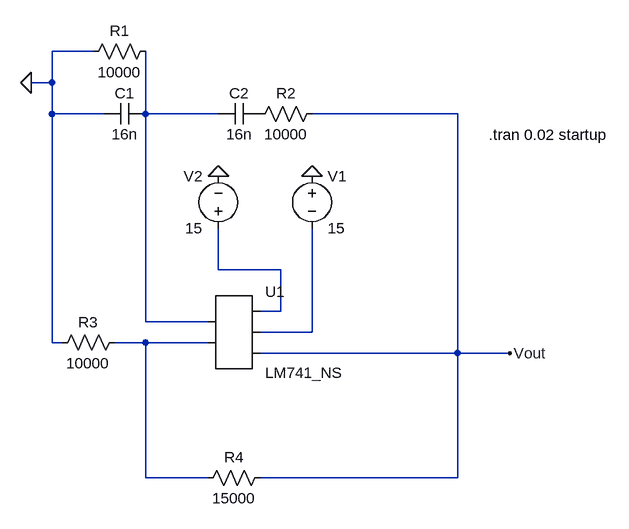
[diagram p0: schematic ee18btech11044_3.asc]
ee18btech11044_3.asc, the LTspice schematic file:
Version 4
SHEET 1 880 680
WIRE -16 -288 -80 -288
WIRE -80 -240 -80 -288
WIRE -80 -240 -112 -240
WIRE -80 -192 -80 -240
WIRE 0 -192 -80 -192
WIRE 64 -192 64 -288
WIRE 176 -192 64 -192
WIRE 544 -192 320 -192
WIRE 176 48 176 -16
WIRE 272 48 176 48
WIRE 272 112 272 48
WIRE 272 112 240 112
WIRE 64 128 64 -192
WIRE 160 128 64 128
WIRE 320 144 320 -16
WIRE 320 144 240 144
WIRE -80 160 -80 -192
WIRE -64 160 -80 160
WIRE 64 160 16 160
WIRE 160 160 64 160
WIRE 544 176 544 -192
WIRE 544 176 240 176
WIRE 624 176 544 176
WIRE 64 368 64 160
WIRE 160 368 64 368
WIRE 544 368 544 176
WIRE 544 368 240 368
FLAG 176 -96 0
FLAG 320 -96 0
FLAG -112 -240 0
FLAG 624 176 Vout
SYMBOL AutoGenerated\\LM741_NS 192 144 R0
SYMATTR InstName U1
SYMBOL cap 64 -208 R90
WINDOW 0 0 32 VBottom 2
WINDOW 3 32 32 VTop 2
SYMATTR InstName C1
SYMATTR Value 16n
SYMBOL res 80 -304 R90
WINDOW 0 0 56 VBottom 2
WINDOW 3 32 56 VTop 2
SYMATTR InstName R1
SYMATTR Value 10000
SYMBOL cap 240 -208 R90
WINDOW 0 0 32 VBottom 2
WINDOW 3 32 32 VTop 2
SYMATTR InstName C2
SYMATTR Value 16n
SYMBOL res 336 -208 R90
WINDOW 0 0 56 VBottom 2
WINDOW 3 32 56 VTop 2
SYMATTR InstName R2
SYMATTR Value 10000
SYMBOL voltage 320 -112 R0
WINDOW 123 0 0 Left 0
WINDOW 39 0 0 Left 0
SYMATTR InstName V1
SYMATTR Value 15
SYMBOL voltage 176 0 R180
WINDOW 0 24 96 Left 2
WINDOW 3 24 16 Left 2
WINDOW 123 0 0 Left 0
WINDOW 39 0 0 Left 0
SYMATTR InstName V2
SYMATTR Value 15
SYMBOL res 32 144 R90
WINDOW 0 0 56 VBottom 2
WINDOW 3 32 56 VTop 2
SYMATTR InstName R3
SYMATTR Value 10000
SYMBOL res 256 352 R90
WINDOW 0 0 56 VBottom 2
WINDOW 3 32 56 VTop 2
SYMATTR InstName R4
SYMATTR Value 15000
TEXT 592 -160 Left 2 !.tran 0.02 startup

The netlist it stands for:
* ee18btech11044_3.asc
* U1: LM741_NS (symbol AutoGenerated\LM741_NS not available, pins judged from their places): pin1=N001 pin2=N004 pin3=N002 pin4=N003 pin5=Vout
C1 N001 0 16n
R1 N001 0 10000
C2 P001 N001 16n
R2 Vout P001 10000
V1 0 N003 15
V2 N002 0 15
R3 N004 0 10000
R4 Vout N004 15000
.tran 0.02 startup
.backanno
.end